# EAGLE board CFT-PB1-revE-TSSOP (EAGLE 5.11), part 1 of 2
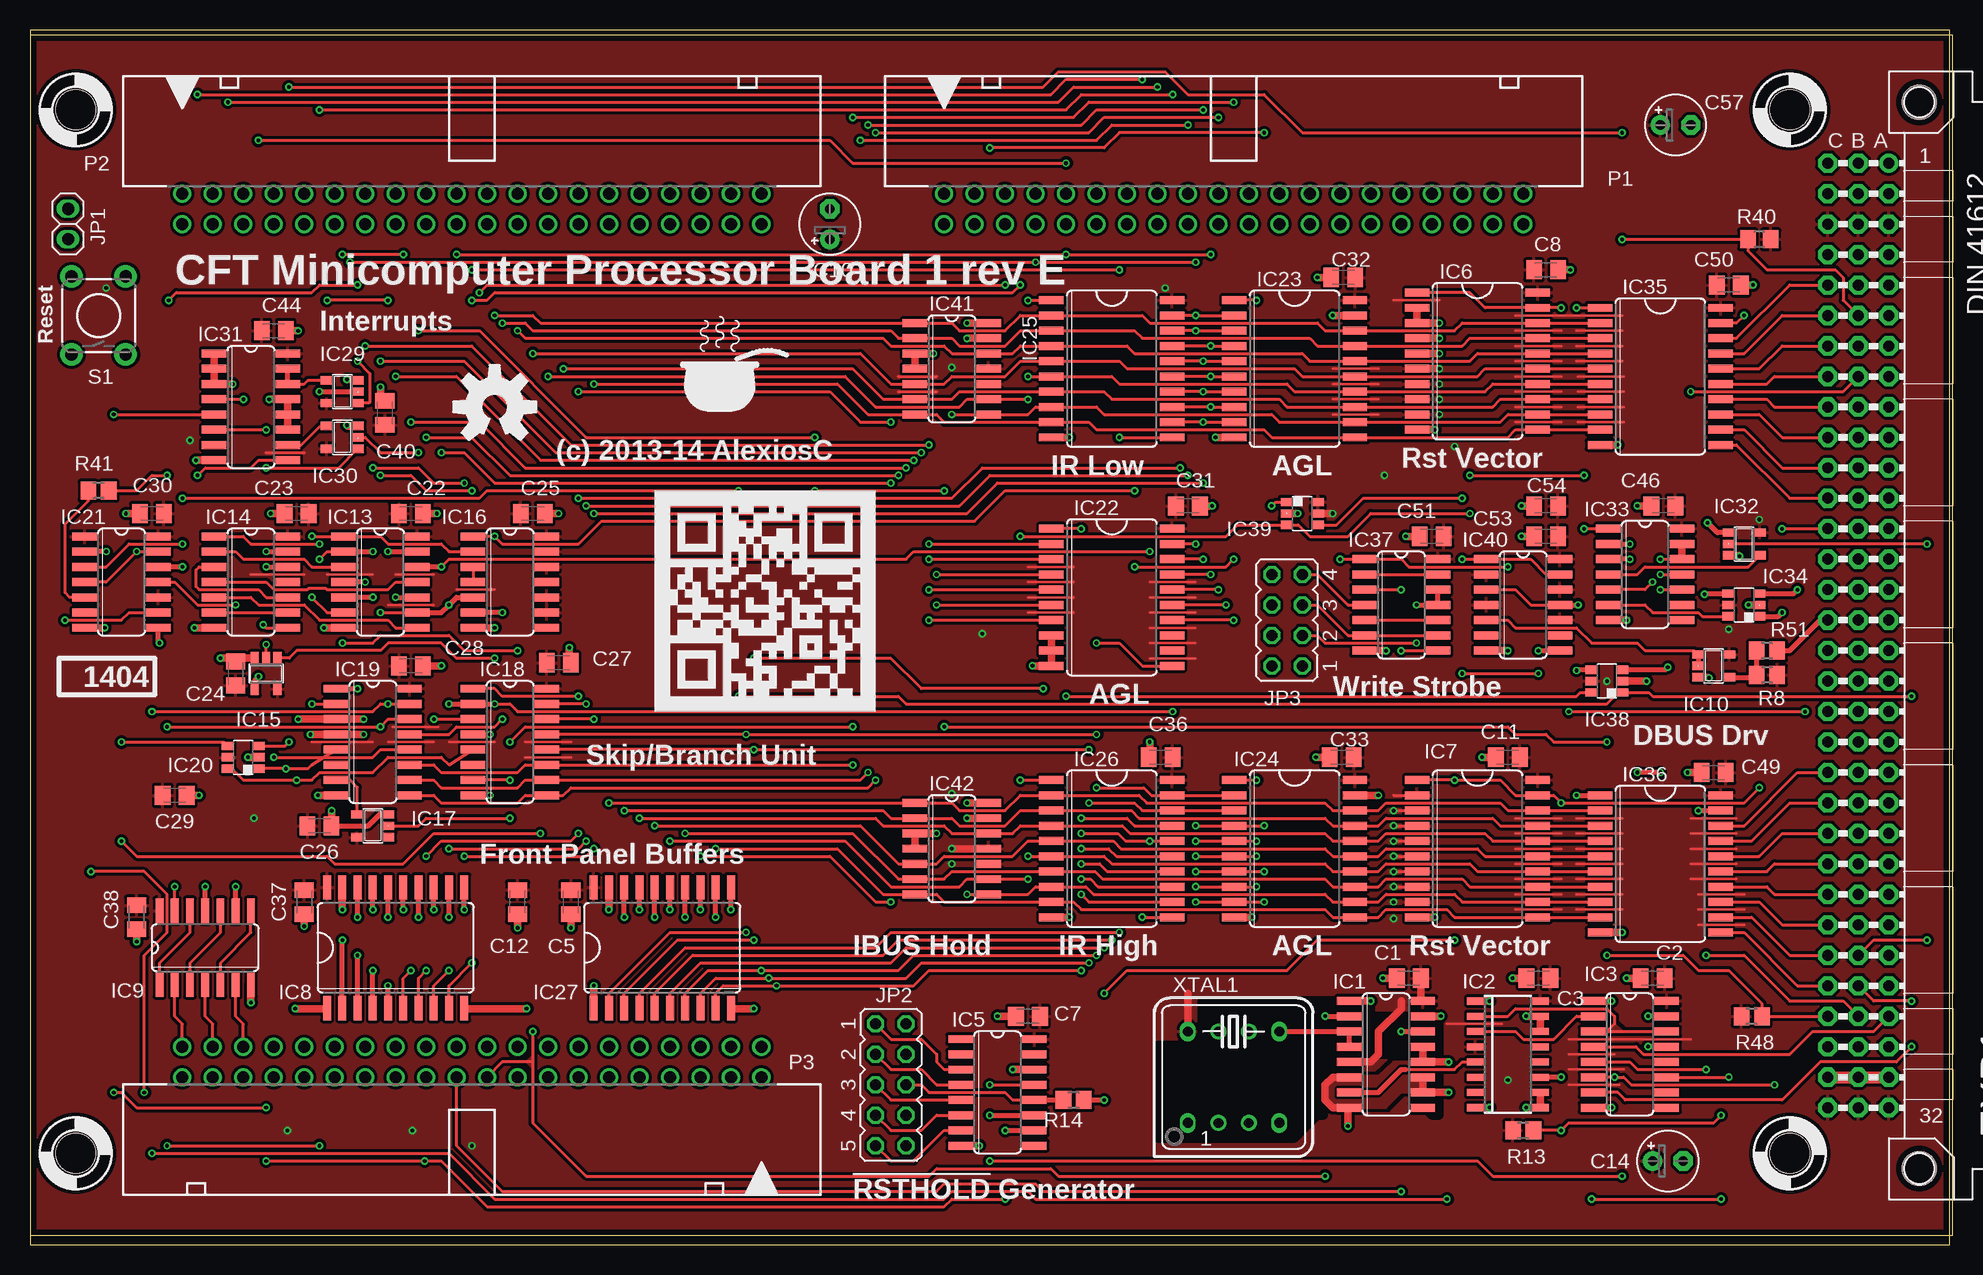
[diagram p10: board, top side]
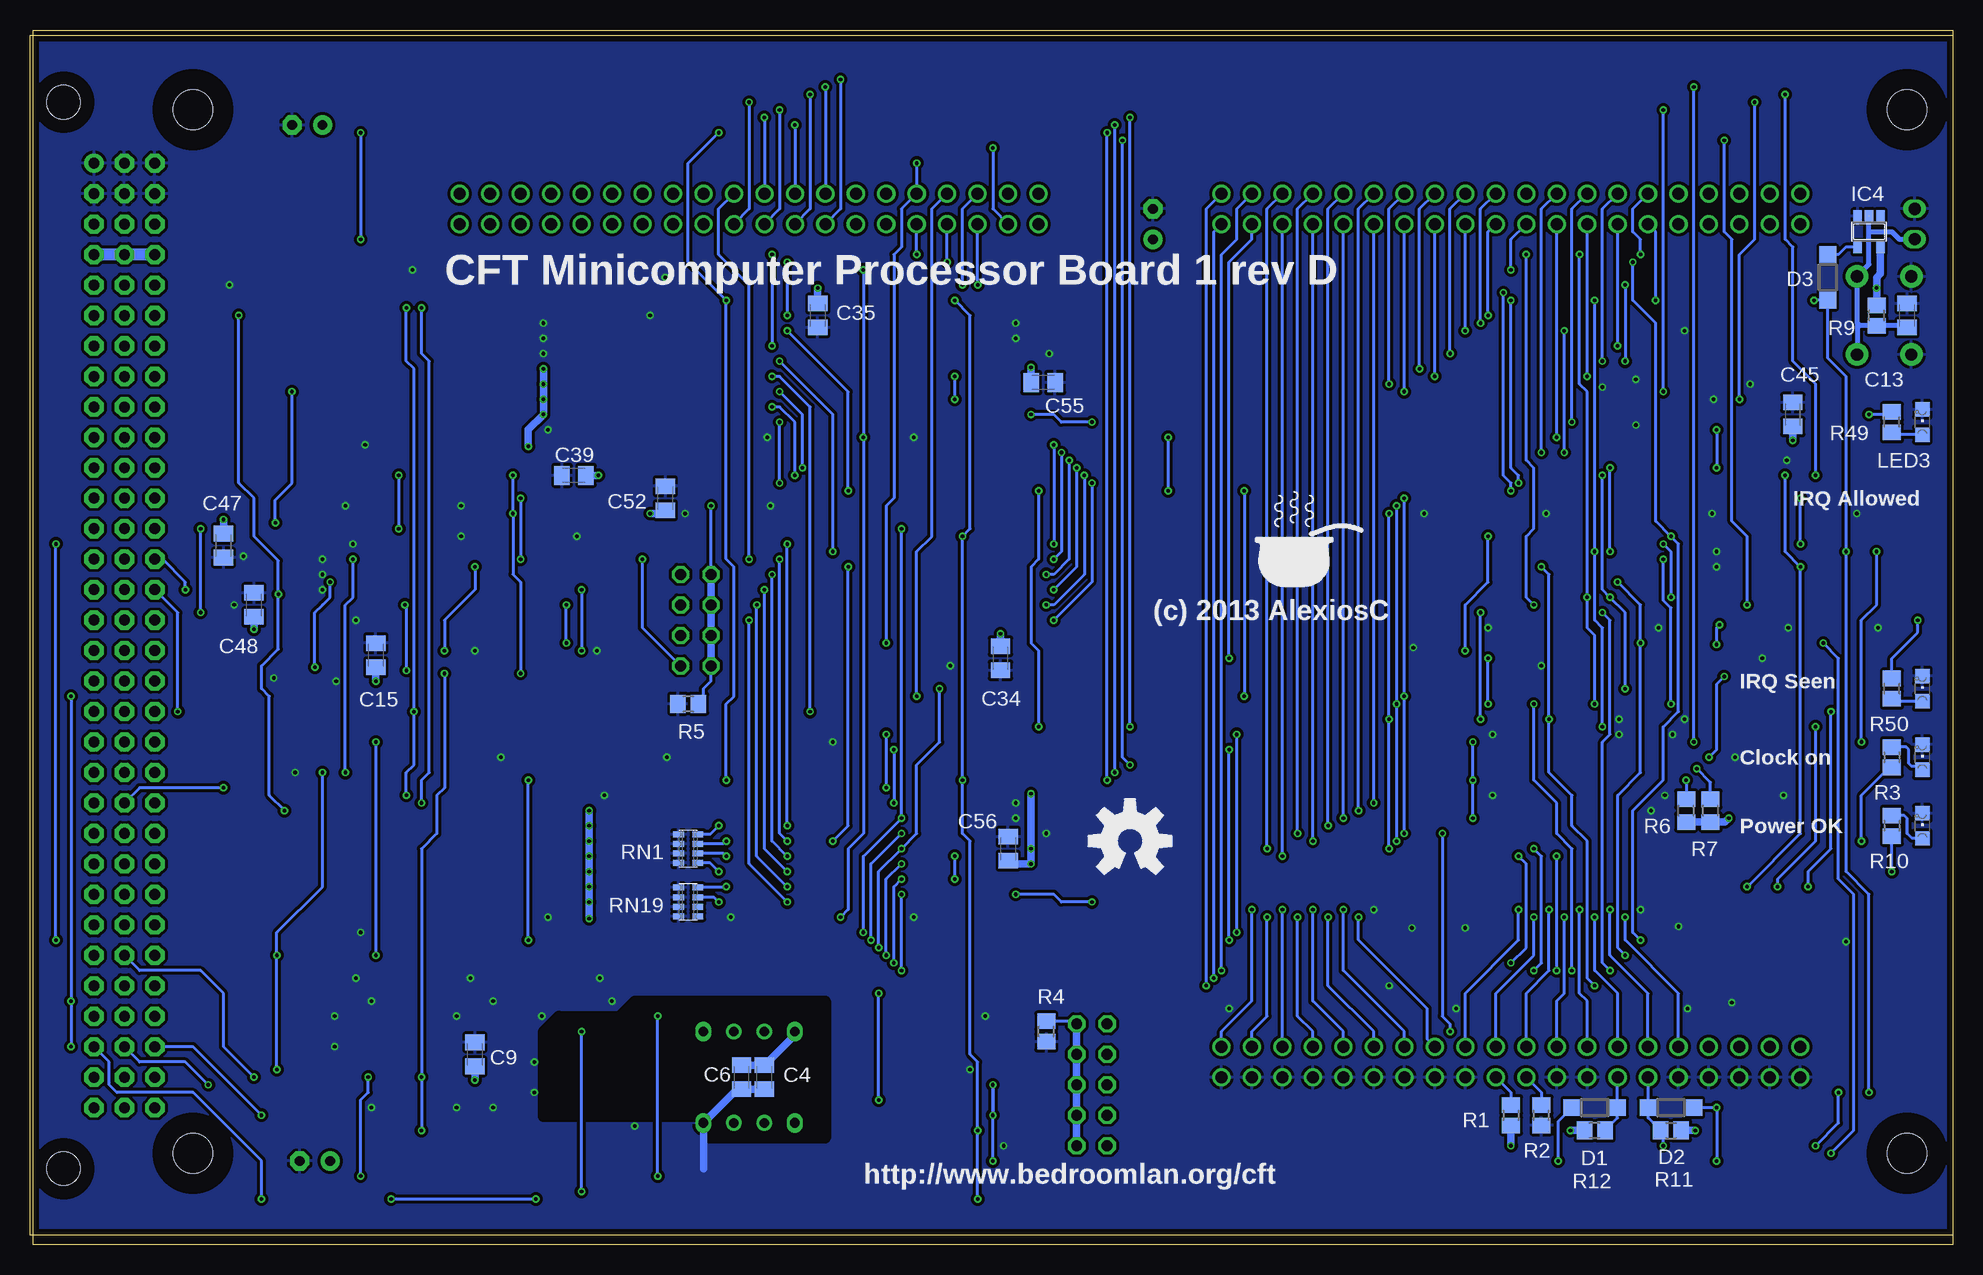
[diagram p11: board, bottom side, seen from below]

Size 160 x 101.27 mm. Coordinates in mm from the lower left corner, seen from the top.
Outline: 0,0 160,0 160,101.27 0,101.27 0,0
Copper layers (1*16): Top 0.035mm / dielectric 1.5mm / Bottom 0.035mm
Design rules "smart-prototyping *": minimum track width 7mil, minimum drill 12mil, track to track 7mil, track to pad 7mil, pad to pad 7mil, via to via 7mil, smd to smd 0mil, copper to edge 20mil, drill to drill 10mil, minimum pad ring 10mil, minimum via ring 6mil, stop-mask expansion 2mil, vias tented up to drill 25mil, thermal gap 10mil
Net classes: 0 default: width 0.254 mm, clearance 0.152 mm; 1 low power: width 0.254 mm, clearance 0.152 mm; 2 Power rails: width 0.61 mm, clearance 0.152 mm
tRestrict: area 94,8.9 to 117.5,20.3
bRestrict: area 94,8.9 to 117.5,20.3

## Footprints (pad centres in the part's own frame; a part is rotated, then mirrored left to right if it is on the bottom)
C0805K = smd 1.3 x 1.6: 1 -1,0; 2 1,0
E2,5-5 = drill 0.813 pad 1.6 round: + -1.27,0 | drill 0.813 pad 1.6 octagon: - 1.27,0
SOD123 = smd 1.4 x 1.4: A 1.9,0; C -1.9,0
VG96K = drill 0.914 pad 1.6 round: A1 154.94,39.37 | drill 0.914 pad 1.6 octagon: A2 154.94,36.83; A3 154.94,34.29; A4 154.94,31.75; A5 154.94,29.21; A6 154.94,26.67; A7 154.94,24.13; A8 154.94,21.59; A9 154.94,19.05; A10 154.94,16.51; A11 154.94,13.97; A12 154.94,11.43; A13 154.94,8.89; A14 154.94,6.35; A15 154.94,3.81; A16 154.94,1.27; A17 154.94,-1.27; A18 154.94,-3.81; A19 154.94,-6.35; A20 154.94,-8.89; A21 154.94,-11.43; A22 154.94,-13.97; A23 154.94,-16.51; A24 154.94,-19.05; A25 154.94,-21.59; A26 154.94,-24.13; A27 154.94,-26.67; A28 154.94,-29.21; A29 154.94,-31.75; A30 154.94,-34.29; A31 154.94,-36.83; A32 154.94,-39.37; B1 152.4,39.37; B2 152.4,36.83; B3 152.4,34.29; B4 152.4,31.75; B5 152.4,29.21; B6 152.4,26.67; B7 152.4,24.13; B8 152.4,21.59; B9 152.4,19.05; B10 152.4,16.51; B11 152.4,13.97; B12 152.4,11.43; B13 152.4,8.89; B14 152.4,6.35; B15 152.4,3.81; B16 152.4,1.27; B17 152.4,-1.27; B18 152.4,-3.81; B19 152.4,-6.35; B20 152.4,-8.89; B21 152.4,-11.43; B22 152.4,-13.97; B23 152.4,-16.51; B24 152.4,-19.05; B25 152.4,-21.59; B26 152.4,-24.13; B27 152.4,-26.67; B28 152.4,-29.21; B29 152.4,-31.75; B30 152.4,-34.29; B31 152.4,-36.83; B32 152.4,-39.37; C1 149.86,39.37; C2 149.86,36.83; C3 149.86,34.29; C4 149.86,31.75; C5 149.86,29.21; C6 149.86,26.67; C7 149.86,24.13; C8 149.86,21.59; C9 149.86,19.05; C10 149.86,16.51; C11 149.86,13.97; C12 149.86,11.43; C13 149.86,8.89; C14 149.86,6.35; C15 149.86,3.81; C16 149.86,1.27; C17 149.86,-1.27; C18 149.86,-3.81; C19 149.86,-6.35; C20 149.86,-8.89; C21 149.86,-11.43; C22 149.86,-13.97; C23 149.86,-16.51; C24 149.86,-19.05; C25 149.86,-21.59; C26 149.86,-24.13; C27 149.86,-26.67; C28 149.86,-29.21; C29 149.86,-31.75; C30 149.86,-34.29; C31 149.86,-36.83; C32 149.86,-39.37 | hole 2.794: 157.48,44.45; 157.48,-44.45
SO16 = smd 0.66 x 2.032: 1 -4.445,-3.073; 2 -3.175,-3.073; 3 -1.905,-3.073; 4 -0.635,-3.073; 5 0.635,-3.073; 6 1.905,-3.073; 7 3.175,-3.073; 8 4.445,-3.073; 9 4.445,3.073; 10 3.175,3.073; 11 1.905,3.073; 12 0.635,3.073; 13 -0.635,3.073; 14 -1.905,3.073; 15 -3.175,3.073; 16 -4.445,3.073
SO16D = smd 0.6 x 1.4: 1 -4.445,-2.715; 2 -3.175,-2.715; 3 -1.905,-2.715; 4 -0.635,-2.715; 5 0.635,-2.715; 6 1.905,-2.715; 7 3.175,-2.715; 8 4.445,-2.715; 9 4.445,2.715; 10 3.175,2.715; 11 1.905,2.715; 12 0.635,2.715; 13 -0.635,2.715; 14 -1.905,2.715; 15 -3.175,2.715; 16 -4.445,2.715
SOT23-5 = smd 0.69 x 0.99: 1 -0.95,-1.29; 2 0,-1.29; 3 0.95,-1.29; 4 0.95,1.3; 5 -0.95,1.3
SO20W = smd 0.66 x 2.032: 1 -5.715,-5.029; 2 -4.445,-5.029; 3 -3.175,-5.029; 4 -1.905,-5.029; 5 -0.635,-5.029; 6 0.635,-5.029; 7 1.905,-5.029; 8 3.175,-5.029; 9 4.445,-5.029; 10 5.715,-5.029; 11 5.715,5.029; 12 4.445,5.029; 13 3.175,5.029; 14 1.905,5.029; 15 0.635,5.029; 16 -0.635,5.029; 17 -1.905,5.029; 18 -3.175,5.029; 19 -4.445,5.029; 20 -5.715,5.029
SO14 = smd 0.66 x 2.032: 1 -3.81,-3.073; 2 -2.54,-3.073; 3 -1.27,-3.073; 4 0,-3.073; 5 1.27,-3.073; 6 2.54,-3.073; 7 3.81,-3.073; 8 3.81,3.073; 9 2.54,3.073; 10 1.27,3.073; 11 0,3.073; 12 -1.27,3.073; 13 -2.54,3.073; 14 -3.81,3.073
DBV_R-PDSO-G6 = smd 0.69 x 0.99: 1 -0.95,-1.29; 2 0,-1.29; 3 0.95,-1.29; 4 0.95,1.3; 5 0,1.3; 6 -0.95,1.3
1X02 = drill 1.016 long: 1 -1.27,0; 2 1.27,0
JP5Q = drill 0.914 octagon: 1 -5.08,-1.27; 2 -5.08,1.27; 3 -2.54,-1.27; 4 -2.54,1.27; 5 0,-1.27; 6 0,1.27; 7 2.54,-1.27; 8 2.54,1.27; 9 5.08,-1.27; 10 5.08,1.27
JP4Q = drill 0.914 octagon: 1 -3.81,-1.27; 2 -3.81,1.27; 3 -1.27,-1.27; 4 -1.27,1.27; 5 1.27,-1.27; 6 1.27,1.27; 7 3.81,-1.27; 8 3.81,1.27
CHIPLED_0805 = smd 1.2 x 1.2: A 0,-1.05; C 0,1.05
PAK100/2500-5-40 = drill 1 pad 1.422 round: 1 -24.13,-1.27; 2 -24.13,1.27; 3 -21.59,-1.27; 4 -21.59,1.27; 5 -19.05,-1.27; 6 -19.05,1.27; 7 -16.51,-1.27; 8 -16.51,1.27; 9 -13.97,-1.27; 10 -13.97,1.27; 11 -11.43,-1.27; 12 -11.43,1.27; 13 -8.89,-1.27; 14 -8.89,1.27; 15 -6.35,-1.27; 16 -6.35,1.27; 17 -3.81,-1.27; 18 -3.81,1.27; 19 -1.27,-1.27; 20 -1.27,1.27; 21 1.27,-1.27; 22 1.27,1.27; 23 3.81,-1.27; 24 3.81,1.27; 25 6.35,-1.27; 26 6.35,1.27; 27 8.89,-1.27; 28 8.89,1.27; 29 11.43,-1.27; 30 11.43,1.27; 31 13.97,-1.27; 32 13.97,1.27; 33 16.51,-1.27; 34 16.51,1.27; 35 19.05,-1.27; 36 19.05,1.27; 37 21.59,-1.27; 38 21.59,1.27; 39 24.13,-1.27; 40 24.13,1.27
R0805 = smd 1.3 x 1.5: 1 -0.85,0; 2 0.85,0
R0805' = smd 1.3 x 1.5: 1 -0.95,0; 2 0.95,0
CTS742C083 = smd 0.5 x 0.9: 1 -1.2,-0.8; 2 -0.4,-0.8; 3 0.4,-0.8; 4 1.2,-0.8; 5 1.2,0.8; 6 0.4,0.8; 7 -0.4,0.8; 8 -1.2,0.8
TACTILE-PTH = drill 1.016 pad 1.88 round: 1 -3.251,2.261; 2 3.251,2.261; 3 -3.251,-2.261; 4 3.251,-2.261
STANDOFF_28_60 = hole 3.302: 0,0
DIL08S-SOCKET = drill 0.813 long: 1 -3.81,-3.81; 4 3.81,-3.81; 5 3.81,3.81; 8 -3.81,3.81 | drill 0.8 round: 2 -1.27,-3.81; 3 1.27,-3.81; 6 1.27,3.81; 7 -1.27,3.81

## Placement (x,y rotation side)
$4_37_$  SIGNATURESILK  [SIGNATURE]  54.61,69.21 0 top
$4_37_$1  SIGNATURESILK  [SIGNATURE]  57.78,54.61 0 bottom
$4_39_$  OSHW-LOGOL  [OSHW-LOGO-L]  38.73,69.85 0 top
$4_39_$1  OSHW-LOGOL  [OSHW-LOGO-L]  68.58,33.66 0 bottom
$4_40_$  QRCODE-CFT  [CFT-QRCODE]  52.07,44.45 0 top
C1  0.1uF  [C0805K]  114.94,22.22 0 top
C2  0.1uF  [C0805K]  135.25,22.22 0 top
C3  0.1uF  [C0805K]  125.73,22.22 0 top
C4  1uF  [C0805K]  100.97,13.97 90 bottom
C5  0.1uF  [C0805K]  45.09,28.57 90 top
C6  0.1uF  [C0805K]  99.06,13.97 90 bottom
C7  0.1uF  [C0805K]  83.19,19.05 0 top
C8  0.1uF  [C0805K]  126.36,81.28 180 top
C9  1uF  [C0805K]  123.19,15.88 270 bottom
C10  1uF  [E2,5-5]  66.67,85.09 90 top
C11  0.1uF  [C0805K]  123.19,40.64 0 top
C12  1uF  [C0805K]  40.64,28.57 90 top
C13  0.1uF  [C0805K]  3.81,77.47 270 bottom
C14  47uF  [E2,5-5]  136.53,6.98 0 top
C15  0.1uF  [C0805K]  131.44,49.15 270 bottom
C22  0.1uF  [C0805K]  31.75,60.96 180 top
C23  0.1uF  [C0805K]  22.23,60.96 0 top
C24  0.1uF  [C0805K]  17.14,47.62 270 top
C25  0.1uF  [C0805K]  41.91,60.96 180 top
C26  0.1uF  [C0805K]  24.13,34.93 180 top
C27  0.1uF  [C0805K]  44.07,48.51 180 top
C28  0.1uF  [C0805K]  31.75,48.26 180 top
C29  0.1uF  [C0805K]  12.06,37.47 180 top
C30  1uF  [C0805K]  10.16,60.96 0 top
C31  0.1uF  [C0805K]  96.52,61.6 180 top
C32  0.1uF  [C0805K]  109.47,80.64 0 top
C33  0.1uF  [C0805K]  109.35,40.64 0 top
C34  1uF  [C0805K]  79.38,48.9 90 bottom
C35  0.1uF  [C0805K]  94.61,77.47 90 bottom
C36  0.1uF  [C0805K]  94.23,40.64 0 top
C37  0.1uF  [C0805K]  22.86,28.57 90 top
C38  0.1uF  [C0805K]  8.89,27.3 90 top
C39  1uF  [C0805K]  114.94,64.14 0 bottom
C40  0.1uF  [C0805K]  29.59,69.34 270 top
C44  0.1uF  [C0805K]  20.32,76.2 180 top
C45  1uF  [C0805K]  13.34,69.21 270 bottom
C46  0.1uF  [C0805K]  136.14,61.6 0 top
C47  0.1uF  [C0805K]  144.15,58.29 90 bottom
C48  0.1uF  [C0805K]  141.6,53.34 270 bottom
C49  0.1uF  [C0805K]  140.34,39.37 0 top
C50  0.1uF  [C0805K]  141.6,80.01 180 top
C51  0.1uF  [C0805K]  116.84,59.05 0 top
C52  0.1uF  [C0805K]  107.31,62.23 270 bottom
C53  0.1uF  [C0805K]  126.36,59.05 0 top
C54  1uF  [C0805K]  126.36,61.6 0 top
C55  0.1uF  [C0805K]  75.82,71.88 180 bottom
C56  0.1uF  [C0805K]  78.74,33.02 270 bottom
C57  47uF  [E2,5-5]  137.16,93.34 0 top
D1  [SOD123]  29.84,11.43 180 bottom
D2  [SOD123]  23.5,11.43 0 bottom
D3  [SOD123]  10.41,80.64 270 bottom
EXP1  [VG96K]  0,50.8 0 top
IC1  74HC253D  [SO16]  113.03,15.88 270 top
IC2  74HC193D  [SO16D]  123.19,15.88 270 top
IC3  74HC139D  [SO16]  133.35,15.88 270 top
IC4  74AHC1G14DBV  [SOT23-5]  6.99,84.45 180 bottom
IC5  74HC590D  [SO16]  80.64,12.7 270 top
IC6  74HC541DW  [SO20W]  120.65,73.66 270 top
IC7  74HC541DW  [SO20W]  120.65,33.02 270 top
IC8  74HC541DW  [SO20W]  30.48,24.77 0 top
IC9  74AC04D  [SO14]  14.61,24.77 0 top
IC10  74HC1G03DBV  [SOT23-5]  140.34,48.26 270 top
IC13  74HC08D  [SO14]  29.21,55.25 270 top
IC14  74HC32D  [SO14]  18.41,55.25 270 top
IC15  74AHC1G86DBV  [SOT23-5]  19.68,47.62 180 top
IC16  74HC32D  [SO14]  40.01,55.25 270 top
IC17  74AHC1G04DBV  [SOT23-5]  28.57,34.93 90 top
IC18  74HC251D  [SO16]  40.01,41.91 270 top
IC19  74HC251D  [SO16]  28.57,41.91 270 top
IC20  74AC1G11DBV  [DBV_R-PDSO-G6]  17.78,40.64 90 top
IC21  74HC74D  [SO14]  7.62,55.25 270 top
IC22  74HC574D  [SO20W]  90.17,53.98 270 top
IC23  74HC541DW  [SO20W]  105.41,73.02 270 top
IC24  74HC541DW  [SO20W]  105.41,33.02 270 top
IC25  74HC573D  [SO20W]  90.17,73.02 270 top
IC26  74HC573D  [SO20W]  90.17,33.02 270 top
IC27  74HC541DW  [SO20W]  52.7,24.77 0 top
IC29  74AHC1G08DBV  [SOT23-5]  26.04,71.12 90 top
IC30  74AHC1G32DBV  [SOT23-5]  26.04,67.31 90 top
IC31  74HC112D  [SO16]  18.41,69.85 270 top
IC32  74AHC1G32DBV  [SOT23-5]  142.88,58.42 270 top
IC33  74HC74D  [SO14]  134.62,55.88 270 top
IC34  74AC1G11DBV  [DBV_R-PDSO-G6]  142.88,53.34 90 top
IC35  74HC245DW  [SO20W]  135.89,72.39 270 top
IC36  74HC245DW  [SO20W]  135.89,31.75 270 top
IC37  74AC04D  [SO14]  114.3,53.34 270 top
IC38  74AC1G27DBV  [DBV_R-PDSO-G6]  131.44,46.99 90 top
IC39  74AC1G11DBV  [DBV_R-PDSO-G6]  106.05,60.96 270 top
IC40  74HC74D  [SO14]  124.46,53.34 270 top
IC41  SN74ACT1071D  [SO14]  76.83,73.02 270 top
IC42  SN74ACT1071D  [SO14]  76.83,33.02 270 top
JP1  [1X02]  3.17,85.09 270 top
JP2  [JP5Q]  71.75,13.33 270 top
JP3  [JP4Q]  104.78,52.07 90 top
LED1  LED-5MM-GREEN  [CHIPLED_0805]  2.54,40.64 0 bottom
LED2  LED-5MM-GREEN  [CHIPLED_0805]  2.54,34.93 0 bottom
LED3  LED-5MM-GREEN  [CHIPLED_0805]  2.54,68.58 0 bottom
LED4  LED-5MM-GREEN  [CHIPLED_0805]  2.54,46.36 0 bottom
P1  2540-5  [PAK100/2500-5-40]  100.33,86.36 0 top
P2  2540-5  [PAK100/2500-5-40]  36.83,86.36 0 top
P3  2540-5  [PAK100/2500-5-40]  36.83,15.24 180 top
R1  4k7  [R0805]  36.83,10.79 270 bottom
R2  4k7  [R0805]  34.29,10.79 90 bottom
R3  330R  [R0805]  5.08,40.64 270 bottom
R4  4k7  [R0805]  75.56,17.78 90 bottom
R5  4k7  [R0805]  105.41,45.09 180 bottom
R6  4k7  [R0805']  22.23,36.2 90 bottom
R7  4k7  [R0805']  20.19,36.2 90 bottom
R8  4k7  [R0805]  144.78,47.5 180 top
R9  50k  [R0805]  6.35,77.47 90 bottom
R10  330R  [R0805]  5.08,34.93 270 bottom
R11  4k7  [R0805]  23.5,9.53 0 bottom
R12  4k7  [R0805]  29.84,9.53 180 bottom
R13  4k7  [R0805]  124.46,9.53 180 top
R14  30R  [R0805]  87,12.06 180 top
R40  4k7  [R0805']  144.15,83.82 180 top
R41  30R  [R0805]  5.71,62.87 180 top
R48  4k7  [R0805]  143.51,19.05 180 top
R49  330R  [R0805]  5.08,68.58 90 bottom
R50  330R  [R0805]  5.08,46.36 90 bottom
R51  30R  [R0805]  144.78,49.53 180 top
RN1  4k7  [CTS742C083]  105.41,33.02 270 bottom
RN19  4k7  [CTS742C083]  105.41,28.57 270 bottom
S1  [TACTILE-PTH]  5.71,77.47 90 top
U1  HOLE  [STANDOFF_28_60]  3.81,94.61 0 top
U2  HOLE  [STANDOFF_28_60]  3.81,7.62 0 top
U3  HOLE  [STANDOFF_28_60]  146.69,94.61 0 top
U4  HOLE  [STANDOFF_28_60]  146.69,7.62 0 top
XTAL1  16.000MHz  [DIL08S-SOCKET]  100.33,13.97 0 top